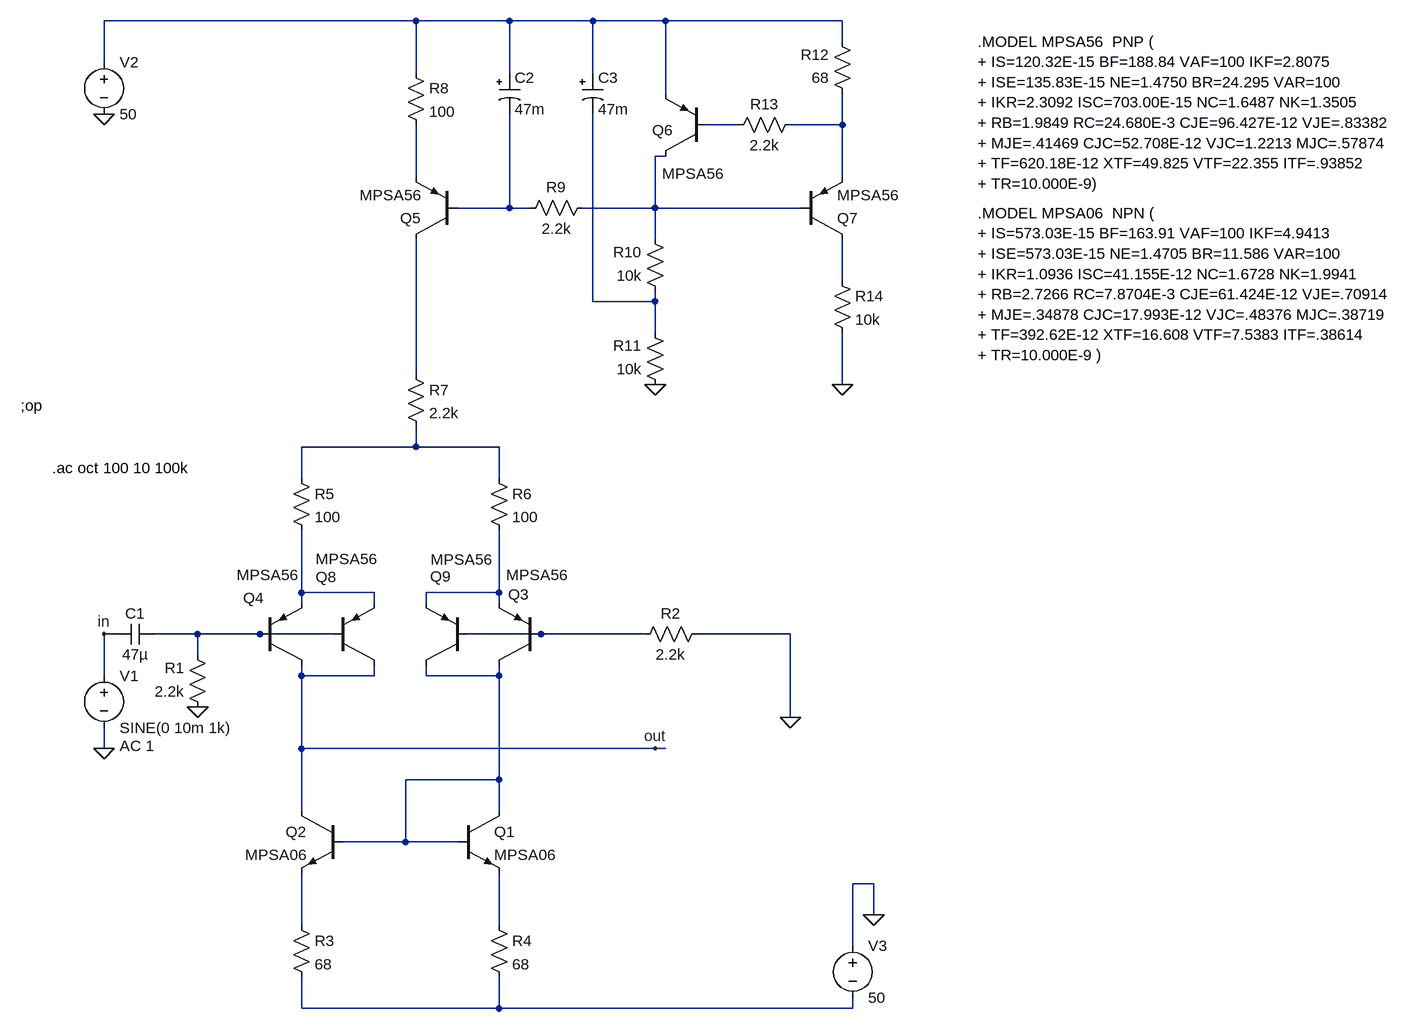
[diagram p0: schematic IPS_real.asc]
IPS_real.asc, the LTspice schematic file:
Version 4
SHEET 1 1584 1128
WIRE 0 -400 -480 -400
WIRE 144 -400 0 -400
WIRE 272 -400 144 -400
WIRE 384 -400 272 -400
WIRE 656 -400 384 -400
WIRE 656 -368 656 -400
WIRE -480 -336 -480 -400
WIRE 0 -320 0 -400
WIRE 144 -320 144 -400
WIRE 272 -320 272 -400
WIRE 384 -288 384 -400
WIRE 496 -240 448 -240
WIRE 656 -240 656 -288
WIRE 656 -240 576 -240
WIRE 384 -192 368 -192
WIRE 0 -160 0 -240
WIRE 656 -160 656 -240
WIRE 144 -112 144 -256
WIRE 144 -112 64 -112
WIRE 176 -112 144 -112
WIRE 368 -112 368 -192
WIRE 368 -112 256 -112
WIRE 592 -112 368 -112
WIRE 368 -64 368 -112
WIRE 656 0 656 -64
WIRE 272 32 272 -256
WIRE 368 32 368 16
WIRE 368 32 272 32
WIRE 368 80 368 32
WIRE 0 144 0 -64
WIRE 656 160 656 80
WIRE 0 256 0 224
WIRE 0 256 -176 256
WIRE 128 256 0 256
WIRE -176 304 -176 256
WIRE 128 304 128 256
WIRE -176 480 -176 384
WIRE -64 480 -176 480
WIRE 128 480 128 384
WIRE 128 480 16 480
WIRE -176 496 -176 480
WIRE -64 496 -64 480
WIRE 16 496 16 480
WIRE 128 496 128 480
WIRE -464 544 -480 544
WIRE -336 544 -400 544
WIRE -240 544 -336 544
WIRE -128 544 -240 544
WIRE 192 544 80 544
WIRE 352 544 192 544
WIRE 576 544 432 544
WIRE -336 576 -336 544
WIRE -480 608 -480 544
WIRE -176 608 -176 592
WIRE -64 608 -64 592
WIRE -64 608 -176 608
WIRE 16 608 16 592
WIRE 128 608 128 592
WIRE 128 608 16 608
WIRE 576 672 576 544
WIRE -480 720 -480 688
WIRE -176 720 -176 608
WIRE 368 720 -176 720
WIRE 384 720 368 720
WIRE 128 768 128 608
WIRE 128 768 -16 768
WIRE -176 816 -176 720
WIRE 128 816 128 768
WIRE -16 864 -16 768
WIRE -16 864 -112 864
WIRE 64 864 -16 864
WIRE 704 928 672 928
WIRE 704 976 704 928
WIRE -176 992 -176 912
WIRE 128 992 128 912
WIRE 672 1024 672 928
WIRE -176 1120 -176 1072
WIRE 128 1120 128 1072
WIRE 128 1120 -176 1120
WIRE 672 1120 672 1104
WIRE 672 1120 128 1120
FLAG -480 720 0
FLAG -480 -256 0
FLAG 704 976 0
FLAG 576 672 0
FLAG -336 656 0
FLAG -480 544 in
FLAG 368 160 0
FLAG 656 160 0
FLAG 368 720 out
SYMBOL npn 64 816 R0
SYMATTR InstName Q1
SYMATTR Value MPSA06
SYMBOL npn -112 816 M0
SYMATTR InstName Q2
SYMATTR Value MPSA06
SYMBOL res 448 528 R90
WINDOW 0 0 56 VBottom 2
WINDOW 3 32 56 VTop 2
SYMATTR InstName R2
SYMATTR Value 2.2k
SYMBOL res -192 976 R0
SYMATTR InstName R3
SYMATTR Value 68
SYMBOL res 112 976 R0
SYMATTR InstName R4
SYMATTR Value 68
SYMBOL res -192 288 R0
SYMATTR InstName R5
SYMATTR Value 100
SYMBOL res 112 288 R0
SYMATTR InstName R6
SYMATTR Value 100
SYMBOL voltage -480 592 R0
WINDOW 123 24 124 Left 2
WINDOW 39 0 0 Left 2
SYMATTR Value2 AC 1
SYMATTR InstName V1
SYMATTR Value SINE(0 10m 1k)
SYMBOL res -16 128 R0
SYMATTR InstName R7
SYMATTR Value 2.2k
SYMBOL voltage -480 -352 R0
SYMATTR InstName V2
SYMATTR Value 50
SYMBOL voltage 672 1008 R0
SYMATTR InstName V3
SYMATTR Value 50
SYMBOL res -320 672 R180
WINDOW 0 36 76 Left 2
WINDOW 3 36 40 Left 2
SYMATTR InstName R1
SYMATTR Value 2.2k
SYMBOL pnp 192 592 R180
WINDOW 0 18 109 Left 2
WINDOW 3 -41 139 Left 2
SYMATTR InstName Q3
SYMATTR Value MPSA56
SYMBOL pnp -240 592 M180
WINDOW 0 -26 104 Left 2
WINDOW 3 -36 139 Left 2
SYMATTR InstName Q4
SYMATTR Value MPSA56
SYMBOL cap -400 528 R90
WINDOW 0 0 32 VBottom 2
WINDOW 3 32 32 VTop 2
SYMATTR InstName C1
SYMATTR Value 47µ
SYMBOL pnp 64 -64 R180
SYMATTR InstName Q5
SYMATTR Value MPSA56
SYMBOL pnp 448 -192 R180
WINDOW 0 52 40 Left 2
WINDOW 3 -25 -27 Left 2
SYMATTR InstName Q6
SYMATTR Value MPSA56
SYMBOL pnp 592 -64 M180
SYMATTR InstName Q7
SYMATTR Value MPSA56
SYMBOL res -16 -336 R0
SYMATTR InstName R8
SYMATTR Value 100
SYMBOL res 272 -128 R90
WINDOW 0 0 56 VBottom 2
WINDOW 3 32 56 VTop 2
SYMATTR InstName R9
SYMATTR Value 2.2k
SYMBOL res 384 32 R180
WINDOW 0 36 76 Left 2
WINDOW 3 36 40 Left 2
SYMATTR InstName R10
SYMATTR Value 10k
SYMBOL res 384 176 R180
WINDOW 0 36 76 Left 2
WINDOW 3 36 40 Left 2
SYMATTR InstName R11
SYMATTR Value 10k
SYMBOL res 672 -272 R180
WINDOW 0 36 76 Left 2
WINDOW 3 36 40 Left 2
SYMATTR InstName R12
SYMATTR Value 68
SYMBOL res 480 -224 R270
WINDOW 0 32 56 VTop 2
WINDOW 3 0 56 VBottom 2
SYMATTR InstName R13
SYMATTR Value 2.2k
SYMBOL polcap 128 -320 R0
SYMATTR InstName C2
SYMATTR Value 47m
SYMATTR SpiceLine V=25
SYMBOL polcap 256 -320 R0
SYMATTR InstName C3
SYMATTR Value 47m
SYMATTR SpiceLine V=25
SYMBOL res 640 -16 R0
SYMATTR InstName R14
SYMATTR Value 10k
SYMBOL pnp -128 592 M180
WINDOW 0 -26 136 Left 2
WINDOW 3 -26 164 Left 2
SYMATTR InstName Q8
SYMATTR Value MPSA56
SYMBOL pnp 80 592 R180
WINDOW 0 26 137 Left 2
WINDOW 3 -37 163 Left 2
SYMATTR InstName Q9
SYMATTR Value MPSA56
TEXT -608 192 Left 2 !;op
TEXT -560 288 Left 2 !.ac oct 100 10 100k
TEXT 864 -368 Left 2 !.MODEL MPSA56  PNP (\n+ IS=120.32E-15 BF=188.84 VAF=100 IKF=2.8075\n+ ISE=135.83E-15 NE=1.4750 BR=24.295 VAR=100\n+ IKR=2.3092 ISC=703.00E-15 NC=1.6487 NK=1.3505\n+ RB=1.9849 RC=24.680E-3 CJE=96.427E-12 VJE=.83382\n+ MJE=.41469 CJC=52.708E-12 VJC=1.2213 MJC=.57874\n+ TF=620.18E-12 XTF=49.825 VTF=22.355 ITF=.93852\n+ TR=10.000E-9)
TEXT 864 -104 Left 2 !.MODEL MPSA06  NPN (\n+ IS=573.03E-15 BF=163.91 VAF=100 IKF=4.9413\n+ ISE=573.03E-15 NE=1.4705 BR=11.586 VAR=100\n+ IKR=1.0936 ISC=41.155E-12 NC=1.6728 NK=1.9941\n+ RB=2.7266 RC=7.8704E-3 CJE=61.424E-12 VJE=.70914\n+ MJE=.34878 CJC=17.993E-12 VJC=.48376 MJC=.38719\n+ TF=392.62E-12 XTF=16.608 VTF=7.5383 ITF=.38614\n+ TR=10.000E-9 )

The netlist it stands for:
* IPS_real.asc
Q1 N015 N015 N017 0 MPSA06
Q2 out N015 N016 0 MPSA06
R2 0 N014 2.2k
R3 N016 N018 68
R4 N017 N018 68
R5 N010 N011 100
R6 N010 N012 100
V1 in 0 SINE(0 10m 1k) AC 1
R7 N009 N010 2.2k
V2 N001 0 50
V3 0 N018 50
R1 0 N013 2.2k
Q3 N015 N014 N012 0 MPSA56
Q4 out N013 N011 0 MPSA56
C1 N013 in 47µ
Q5 N009 N006 N005 0 MPSA56
Q6 N004 N002 N001 0 MPSA56
Q7 N007 N004 N003 0 MPSA56
R8 N001 N005 100
R9 N004 N006 2.2k
R10 N008 N004 10k
R11 0 N008 10k
R12 N003 N001 68
R13 N002 N003 2.2k
C2 N001 N006 47m V=25
C3 N001 N008 47m V=25
R14 N007 0 10k
Q8 out N013 N011 0 MPSA56
Q9 N015 N014 N012 0 MPSA56
.model NPN NPN
.model PNP PNP
.lib standard.bjt
;op
.ac oct 100 10 100k
.MODEL MPSA56  PNP (
+ IS=120.32E-15 BF=188.84 VAF=100 IKF=2.8075
+ ISE=135.83E-15 NE=1.4750 BR=24.295 VAR=100
+ IKR=2.3092 ISC=703.00E-15 NC=1.6487 NK=1.3505
+ RB=1.9849 RC=24.680E-3 CJE=96.427E-12 VJE=.83382
+ MJE=.41469 CJC=52.708E-12 VJC=1.2213 MJC=.57874
+ TF=620.18E-12 XTF=49.825 VTF=22.355 ITF=.93852
+ TR=10.000E-9)
.MODEL MPSA06  NPN (
+ IS=573.03E-15 BF=163.91 VAF=100 IKF=4.9413
+ ISE=573.03E-15 NE=1.4705 BR=11.586 VAR=100
+ IKR=1.0936 ISC=41.155E-12 NC=1.6728 NK=1.9941
+ RB=2.7266 RC=7.8704E-3 CJE=61.424E-12 VJE=.70914
+ MJE=.34878 CJC=17.993E-12 VJC=.48376 MJC=.38719
+ TF=392.62E-12 XTF=16.608 VTF=7.5383 ITF=.38614
+ TR=10.000E-9 )
.backanno
.end